# Altium schematic sheet Port_Connection_Rules.SchDoc
size 111 x 66 mm
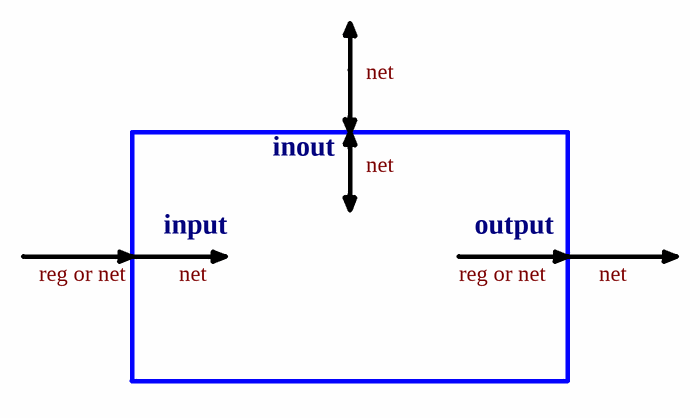
[diagram p0: Port_Connection_Rules.SchDoc]

## Notes on the sheet
- net
- inout
- reg or net
- input
- output